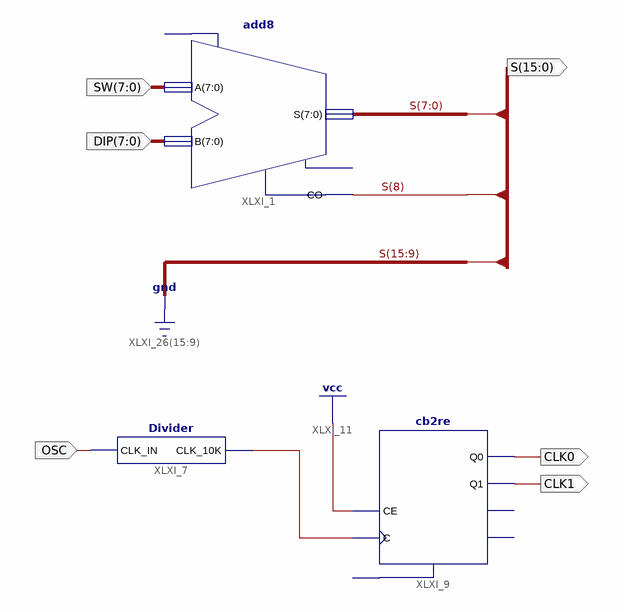
[diagram p0: schematic sheet 1]
// Xilinx ISE schematic Adder.sch (spartan6) as structural Verilog: 3 symbols, 6 ports
module Adder (
  input  [7:0] SW,
  input  [7:0] DIP,
  input  OSC,
  output [15:0] S,
  output CLK0,
  output CLK1
);

  wire XLXN_9;

  add8 XLXI_1 (.A(SW), .B(DIP), .CO(S[8]), .S(S[7:0]));  // open: CI, OFL
  Divider XLXI_7 (.CLK_IN(OSC), .CLK_10K(XLXN_9));
  cb2re XLXI_9 (.C(XLXN_9), .CE(1'b1), .Q0(CLK0), .Q1(CLK1));  // open: R, CEO, TC

  assign S[15:9] = {7{1'b0}};
endmodule
